# Altium project USB_RS485.PrjPcb
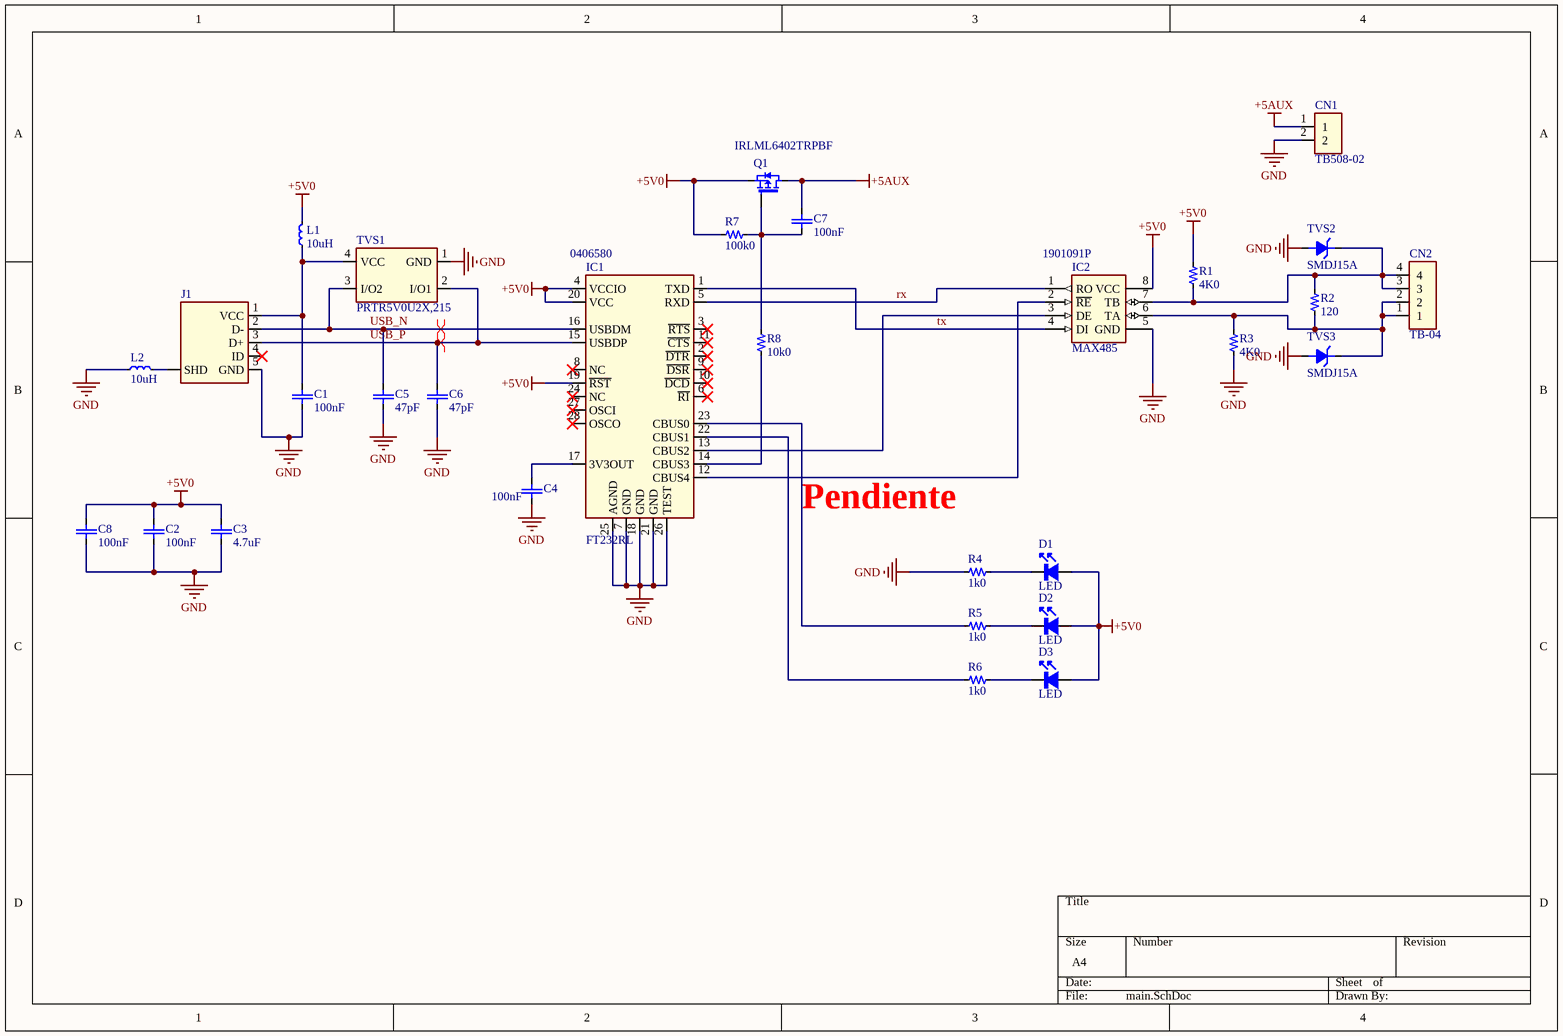
[diagram p0: main.SchDoc]
1 sheet, 30 parts. Net scope: global (net labels, ports and power ports of the same name join across sheets).
Board file: PCB1.PcbDoc

## Sheet main.SchDoc
size A4; SheetNumber: 1; SheetTotal: 1

### Parts
C1  100nF  [C0805]
C2  100nF  [C0805]
C3  4.7uF  [C0805]
C4  100nF  [C0805]
C5  47pF  [C0805]
C6  47pF  [C0805]
C7  100nF  [C0805]
C8  100nF  [C0805]
CN1  TB508-02  [TB508-02]
CN2  TB-04  [TB508-04]
D1  LED  [LED-1210]
D2  LED  [LED-0805]
D3  LED  [LED-0805]
IC1  FT232RL  Supplier Part Number 1: 0406580  [SSOP-28]
IC2  MAX485  Supplier Part Number 1: 1901091P  [SOIC8-N]
J1  690-005-299-043  [USB-Mini]  (value not drawn)
L1  10uH  [L0805]
L2  10uH  [L0805]
Q1  IRLML6402TRPBF  [SOT23-3]
R1  4K0  [R0805]
R2  120  [R0805]
R3  4K0  [R0805]
R4  1k0  [R0805]
R5  1k0  [R0805]
R6  1k0  [R0805]
R7  100k0  [R0805]
R8  10k0  [R0805]
TVS1  PRTR5V0U2X,215  [SOT143-4]
TVS2  SMDJ15A  [SOD123]
TVS3  SMDJ15A  [SOD123]

### Nets
+5AUX: C7.2 CN1.1 Q1.3(D)
+5V0: C2.2 C3.1 C8.2 D1.2 D2.2 D3.2 IC1.4(VCCIO) IC1.19(~{RST}) IC1.20(VCC) IC2.8(VCC) L1.2 Q1.2(S) R1.2 R7.1
GND: C1.1 C2.1 C3.2 C4.1 C5.1 C6.1 C8.1 CN1.2 IC1.7(GND) IC1.18(GND) IC1.21(GND) IC1.25(AGND) IC1.26(TEST) IC2.5(GND) J1.5(GND) L2.1 R3.1 R4.1 TVS1.1(GND) TVS2.2 TVS3.2
rx: IC1.5(RXD) IC2.1(RO)
tx: IC1.1(TXD) IC2.4(DI)
USB_N: C5.2 IC1.16(USBDM) J1.2(D-) TVS1.3(I/O2)
USB_P: C6.2 IC1.15(USBDP) J1.3(D+) TVS1.2(I/O1)
NetC1_2: C1.2 J1.1(VCC) L1.1 TVS1.4(VCC)
NetC4_2: C4.2 IC1.17(3V3OUT)
NetC7_1: C7.1 Q1.1(G) R7.2 R8.2
NetCN2_1: CN2.1 CN2.2 IC2.6(TA) R2.1 R3.2 TVS3.1
NetCN2_3: CN2.3 CN2.4 IC2.7(TB) R1.1 R2.2 TVS2.1
NetD1_1: D1.1 R4.2
NetD2_1: D2.1 R5.2
NetD3_1: D3.1 R6.2
NetIC1_12: IC1.12(CBUS4) IC2.2(~{RE})
NetIC1_13: IC1.13(CBUS2) IC2.3(DE)
NetIC1_14: IC1.14(CBUS3) R8.1
NetIC1_22: IC1.22(CBUS1) R6.1
NetIC1_23: IC1.23(CBUS0) R5.1
NetJ1_SHD: J1.SHD L2.2

Not connected (* = marked no-connect by the designer): IC1 2(~{DTR})* 3(~{RTS})* 6(~{RI})* 8(NC)* 9(~{DSR})* 10(~{DCD})* 11(~{CTS})* 24(NC)* 27(OSCI)* 28(OSCO)*; J1 4(ID)*

### Layout directives
differential pair: USB_N, USB_P

### Notes on the sheet
- Pendiente

### Library data of the parts
C1 C2 C4 C7 C8 = Capacitor: Capacitor without polarity; Voltage: 25V; Part number: *; Manufacturer: *; Unit price: *; Value: 100nF
C3 C5 C6 = Capacitor: Capacitor without polarity; Value: 100nF; Voltage: 25V; Part number: *; Manufacturer: *; Unit price: *
CN1 = TB-02: Terminal Block; Manufacturer: *; Part number: *; Unit price: *; Value: TB508-02
CN2 = TB-04: Terminal Block; Manufacturer: *; Part number: *; Unit price: *; Value: TB-04
D1-D3 = LED: LED - Light-Emitting Diode; Manufacturer: *; Part number: *; Unit price: *; Value: LED
IC1 = FT232: USB Bridge, USB to UART USB 2.0 UART Interface 28-SSOP; Value: FT232RL; Manufacturer: *; Part number: *; Unit price: *; Supplier 1: RSComponents
IC2 = MAX485: IC TRANSCEIVER HALF 1/1 8SOIC; Manufacturer: *; Part number: *; Unit price: *; Value: MAX485; Supplier 1: RSComponents
J1 = USB-Mini-B: CONN RCPT USB2.0 MINI B SMD R/A; Manufacturer: *; Part number: *; Unit price: *; Value: 690-005-299-043
L1 L2 = Inductor: Inductor for low power; Max. current: 0.5A; Core type: Ferrite; Manufacturer: *; Part number: *; Value: 10uH; Unit price: 0.1
Q1 = MOSFET-P-LP: P-Channel 20V 3.7A (Ta) 1.3W (Ta) /SOT-23 - LowPower; Part number: *; Manufacturer: *; Unit price: *; Value: IRLML6402TRPBF
R1-R3 R7 R8 = Resistor: Single resistor; Value: 1k0; Power: 0.125W; Manufacturer: *; Part number: *; Unit price: 0.1
R4-R6 = Resistor: Single resistor; Power: 0.125W; Manufacturer: *; Part number: *; Value: 1k0; Unit price: 0.1
TVS1 = TVS-DUAL-SOT143B: Clamp  Ipp Tvs Diode Surface Mount SOT-143B; Part number: *; Manufacturer: *; Decription: *; Unit price: *; Value: PRTR5V0U2X,215
TVS2 TVS3 = TVS-SINGLE: TVS DIODE - Transient Voltage Suppression Diode; Part number: *; Manufacturer: *; Decription: *; Unit price: *; Value: SMDJ15A